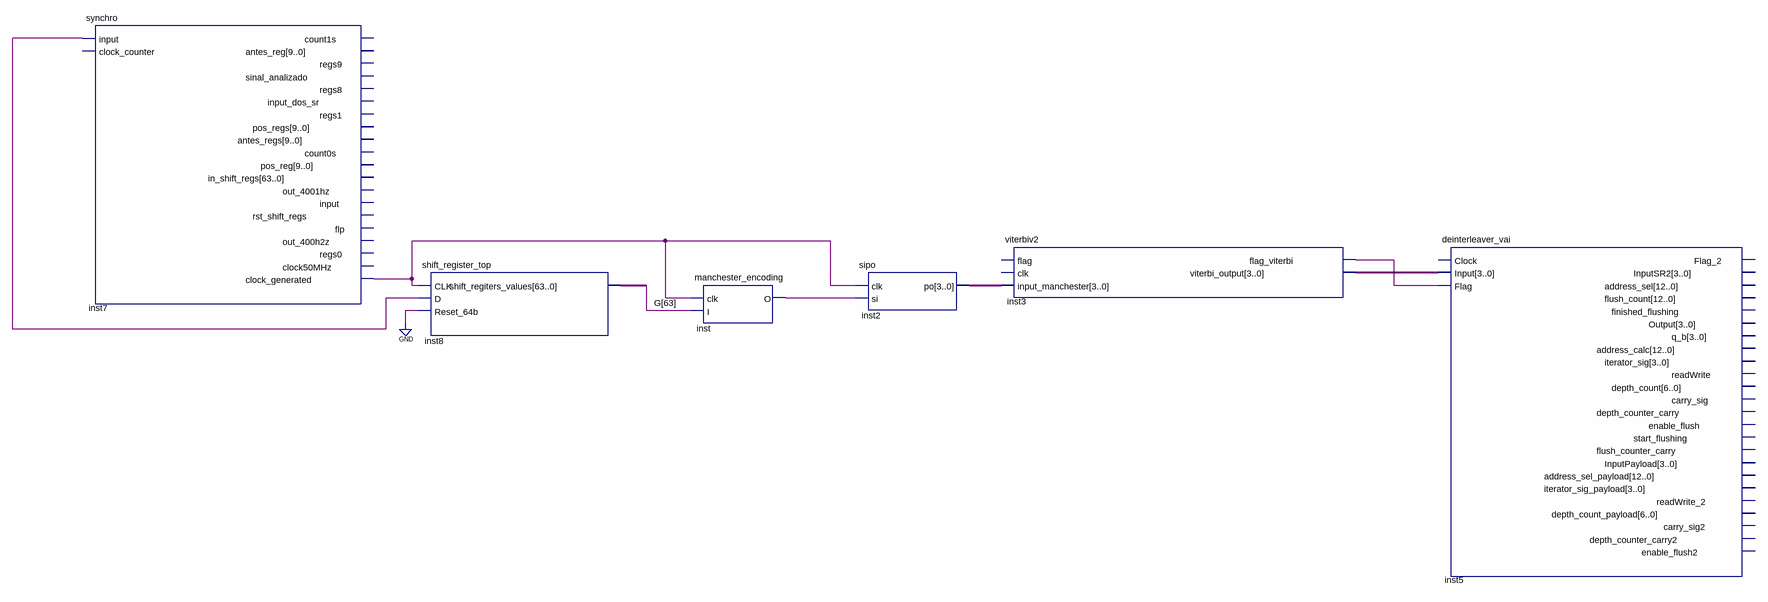
[diagram p0: schematic sheet]
// Quartus schematic decoderInt.bdf as structural Verilog: 6 symbols, 0 pins
module decoderInt (
);

  wire inst3_flag_viterbi, inst7_clock_generated, inst_o, undriven;
  wire [3:0] inst2_po, inst3_viterbi_output;
  wire [63:0] inst8_shift_regiters_values;
  wire [63:63] G;

  synchro inst7 (
    .\input ({undriven, 1'bz}), .clock_generated(inst7_clock_generated));  // open: clock_counter, count1s, antes_reg, regs9, sinal_analizado, regs8, input_dos_sr, regs1, pos_regs, antes_regs, count0s, pos_reg, in_shift_regs, out_4001hz, rst_shift_regs, flp, out_400h2z, regs0, clock50MHz
  shift_register_top inst8 (
    .CLK(inst7_clock_generated), .D(undriven), .Reset_64b(1'b0),
    .shift_regiters_values(inst8_shift_regiters_values));
  manchester_encoding inst (.clk(inst7_clock_generated), .I(G[63]), .O(inst_o));
  sipo inst2 (.clk(inst7_clock_generated), .si(inst_o), .po(inst2_po));
  viterbiv2 inst3 (
    .input_manchester(inst2_po), .flag_viterbi(inst3_flag_viterbi), .viterbi_output(inst3_viterbi_output));  // open: flag, clk
  deinterleaver_vai inst5 (
    .Input(inst3_viterbi_output), .Flag(inst3_flag_viterbi));  // open: Clock, Flag_2, InputSR2, address_sel, flush_count, finished_flushing, Output, q_b, address_calc, iterator_sig, readWrite, depth_count, carry_sig, depth_counter_carry, enable_flush, start_flushing, flush_counter_carry, InputPayload, address_sel_payload, iterator_sig_payload, readWrite_2, depth_count_payload, carry_sig2, depth_counter_carry2, enable_flush2
endmodule
